# Altium project roboPCB.PrjPcb
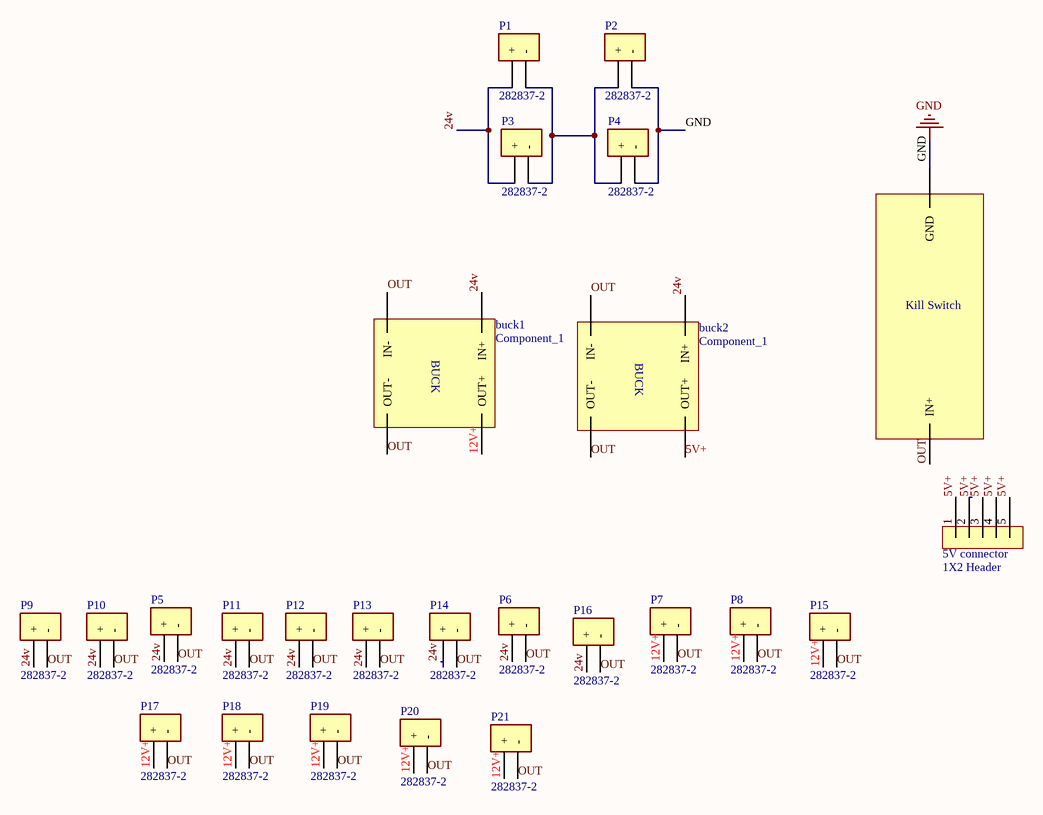
[diagram p0: Sheet1.SchDoc]
1 sheet, 25 parts. Net scope: global (net labels, ports and power ports of the same name join across sheets).
Board file: PCB1.PcbDoc

## Sheet Sheet1.SchDoc
size A4; SheetNumber: 1; SheetTotal: 1

### Parts
5V_connector  1X2 Header  [Connector]
buck1  Component_1  [buck - duplicate]
buck2  Component_1  [buck - duplicate]
KS  KS  [KS]  (value not drawn)
P1  282837-2  [TE_282837-2]
P2  282837-2  [TE_282837-2]
P3  282837-2  [TE_282837-2]
P4  282837-2  [TE_282837-2]
P5  282837-2  [TE_282837-2]
P6  282837-2  [TE_282837-2]
P7  282837-2  [TE_282837-2]
P8  282837-2  [TE_282837-2]
P9  282837-2  [TE_282837-2]
P10  282837-2  [TE_282837-2]
P11  282837-2  [TE_282837-2]
P12  282837-2  [TE_282837-2]
P13  282837-2  [TE_282837-2]
P14  282837-2  [TE_282837-2]
P15  282837-2  [TE_282837-2]
P16  282837-2  [TE_282837-2]
P17  282837-2  [TE_282837-2]
P18  282837-2  [TE_282837-2]
P19  282837-2  [TE_282837-2]
P20  282837-2  [TE_282837-2]
P21  282837-2  [TE_282837-2]

### Nets
GND: KS.2(GND) P2.2(-) P4.2(-)
5V+: 5V_connector.1 5V_connector.2 5V_connector.3 5V_connector.4 5V_connector.5 buck2.4(OUT+)
12V+: buck1.4(OUT+) P7.1(+) P8.1(+) P15.1(+) P17.1(+) P18.1(+) P19.1(+) P20.1(+) P21.1(+)
24v: buck1.2(IN+) buck2.2(IN+) P1.1(+) P3.1(+) P5.1(+) P6.1(+) P9.1(+) P10.1(+) P11.1(+) P12.1(+) P13.1(+) P14.1(+) P16.1(+)
OUT: buck1.1(IN-) buck1.3(OUT-) buck2.1(IN-) buck2.3(OUT-) KS.1(IN+) P5.2(-) P6.2(-) P7.2(-) P8.2(-) P9.2(-) P10.2(-) P11.2(-) P12.2(-) P13.2(-) P14.2(-) P15.2(-) P16.2(-) P17.2(-) P18.2(-) P19.2(-) P20.2(-) P21.2(-)
NetP1_2: P1.2(-) P2.1(+) P3.2(-) P4.1(+)

### Notes on the sheet
- (in symbol Component_1) BUCK
- (in symbol KS) Kill Switch

### Library data of the parts
5V_connector = 640456-4: Board Connector, 4 Contact(s), 1 Row(s), Male, Straight, 0.1 inch Pitch, Solder Terminal, Friction Lock, Natural Insulator; Manufacturer: TE Connectivity; Option: General Purpose; Contact Pattern: RECTANGULAR; Contact Style: SQ PIN-SKT; Filter Feature: No; Mating Information: MULTIPLE MATING PARTS AVAILABLE; Number Of Connectors: 1; Polarization Key: POLARIZED HOUSING; Number of Contacts: 4; Body/Shell Style: PLUG; Additional Feature: POLARIZED; Mounting Option 1: LOCKING; Body Depth: 0.31inch; Body Breadth: 0.225inch; Body Length: 0.4inch; Reference Standard: UL; Reliability: COMMERCIAL; Supplier: Avnet; Supplier Part Number: 90F5641; Manufacturer Part Number: 640456-4; Category: Connectors; Stock: 46164; Pricing: 1=0.234, 10=0.193, 25=0.183, 100=0.173, 500=0.155 (USD); Mounting Technology: Board; Contact Finish - Mating: NOT SPECIFIED; Contact Finish - Termination: Tin (Sn); Insulation Color: Natural; Insulation Material: Polyester; Min Operating Temperature: -55°C; Max Operating Temperature: 105°C; Connector Type: BOARD CONNECTOR; JESD-609 Code: e3; Contact Gender: Male; Mixed Contacts: No; Mounting Style: STRAIGHT; Number of Rows Loaded: 1; Termination: Solder; Number Of PCB Rows: 1; PCB Contact Pattern: RECTANGULAR; Mating Contact Pitch: 0.1inch; Terminal Pitch: 2.54mm; Mounting Option 2: FRICTION LOCK; Terminal Length: 0.14inch; Flammability Rating: UL94 V-0; DIN Conformance: No; IEC Conformance: No; MIL Conformance: No; Reach SVHC Compliant: Yes; RoHS Compliant: Yes; ComponentLink1URL: https://www.te.com:443/usa-en/product-640456-4.datasheet.pdf?src-supplier=IHS+Markit; ComponentLink1Description: https://www.te.com:443/usa-en/product-640456-4.datasheet.pdf?src-supplier=IHS+Markit; ComponentLink2URL: https://datasheet.ciiva.com/36859/38054-36859312.pdf?src-supplier=Farnell; ComponentLink2Description: https://datasheet.ciiva.com/36859/38054-36859312.pdf?src-supplier=Farnell; ComponentLink3URL: https://datasheet.ciiva.com/25618/0900766b80eb7fdd-25618242.pdf?src-supplier=Rs; ComponentLink3Description: https://datasheet.ciiva.com/25618/0900766b80eb7fdd-25618242.pdf?src-supplier=Rs; ComponentLink4URL: https://datasheet.ciiva.com/16286/eng-ds-82056-mta-0608-16286228.pdf?src-supplier=Future+Electronics; ComponentLink4Description: https://datasheet.ciiva.com/16286/eng-ds-82056-mta-0608-16286228.pdf?src-supplier=Future+Electronics; ComponentLink5URL: https://datasheet.ciiva.com/11746/0900766b80027008-11746331.pdf?src-supplier=Rs; ComponentLink5Description: https://datasheet.ciiva.com/11746/0900766b80027008-11746331.pdf?src-supplier=Rs; ComponentLink6URL: https://datasheet.ciiva.com/19462/613958-19462402.pdf?src-supplier=Jameco; ComponentLink6Description: https://datasheet.ciiva.com/19462/613958-19462402.pdf?src-supplier=Jameco; ComponentLink7URL: https://datasheet.ciiva.com/14637/70083644-14637814.pdf?src-supplier=Allied+Electronics; ComponentLink7Description: https://datasheet.ciiva.com/14637/70083644-14637814.pdf?src-supplier=Allied+Electronics; ComponentLink8URL: https://datasheet.ciiva.com/709/eng-cd-640456-w2-709689.pdf?src-supplier=Digikey; ComponentLink8Description: https://datasheet.ciiva.com/709/eng-cd-640456-w2-709689.pdf?src-supplier=Digikey; ComponentLink9URL: https://datasheet.ciiva.com/14156/mta-cst-100-sl-156-eng-datasheet-14156822.pdf?src-supplier=Distrelec; ComponentLink9Description: https://datasheet.ciiva.com/14156/mta-cst-100-sl-156-eng-datasheet-14156822.pdf?src-supplier=Distrelec; ComponentLink10URL: https://datasheet.ciiva.com/16656/eng-ds-82056-mta-0608-16656524.pdf?; ComponentLink10Description: https://datasheet.ciiva.com/16656/eng-ds-82056-mta-0608-16656524.pdf?
P1-P21 = 282837-2: Ð Ð°Ð·ÑŠÐµÐ¼Ð½Ñ‹Ðµ ÐºÐ»ÐµÐ¼Ð¼Ð½Ñ‹Ðµ ÐºÐ¾Ð»Ð¾Ð´ÐºÐ¸ Ð Ð¾Ð·ÐµÑ‚ÐºÐ° 2 Ð¿Ð¾Ð»Ð¾Ð¶ÐµÐ½Ð¸Ñ 5,08 Ð¼Ð¼ ÐŸÑ€Ð¸Ð¿Ð¾Ð¹ Ð¿Ñ€ÑÐ¼Ð¾Ð¹ Ñ‡ÐµÑ€ÐµÐ· Ð¾Ñ‚Ð²ÐµÑ€ÑÑ‚Ð¸Ðµ 13,5 Ð / ÐºÐ¾Ð½Ñ‚Ð°ÐºÑ‚; MF: TE Connectivity; SnapEDA_Link: https://www.snapeda.com/parts/282837-2/TE+Connectivity+AMP+Connectors/view-part/?ref=snap; Price: None; Check_prices: https://www.snapeda.com/parts/282837-2/TE+Connectivity+AMP+Connectors/view-part/?ref=eda; Purchase-URL: https://pricing.snapeda.com/search/part/282837-2/?ref=eda; MP: 282837-2; Value: *; Availability: In Stock; Package: None